# EAGLE design CurveTracerArduinoV2 (EAGLE 7.4.0)
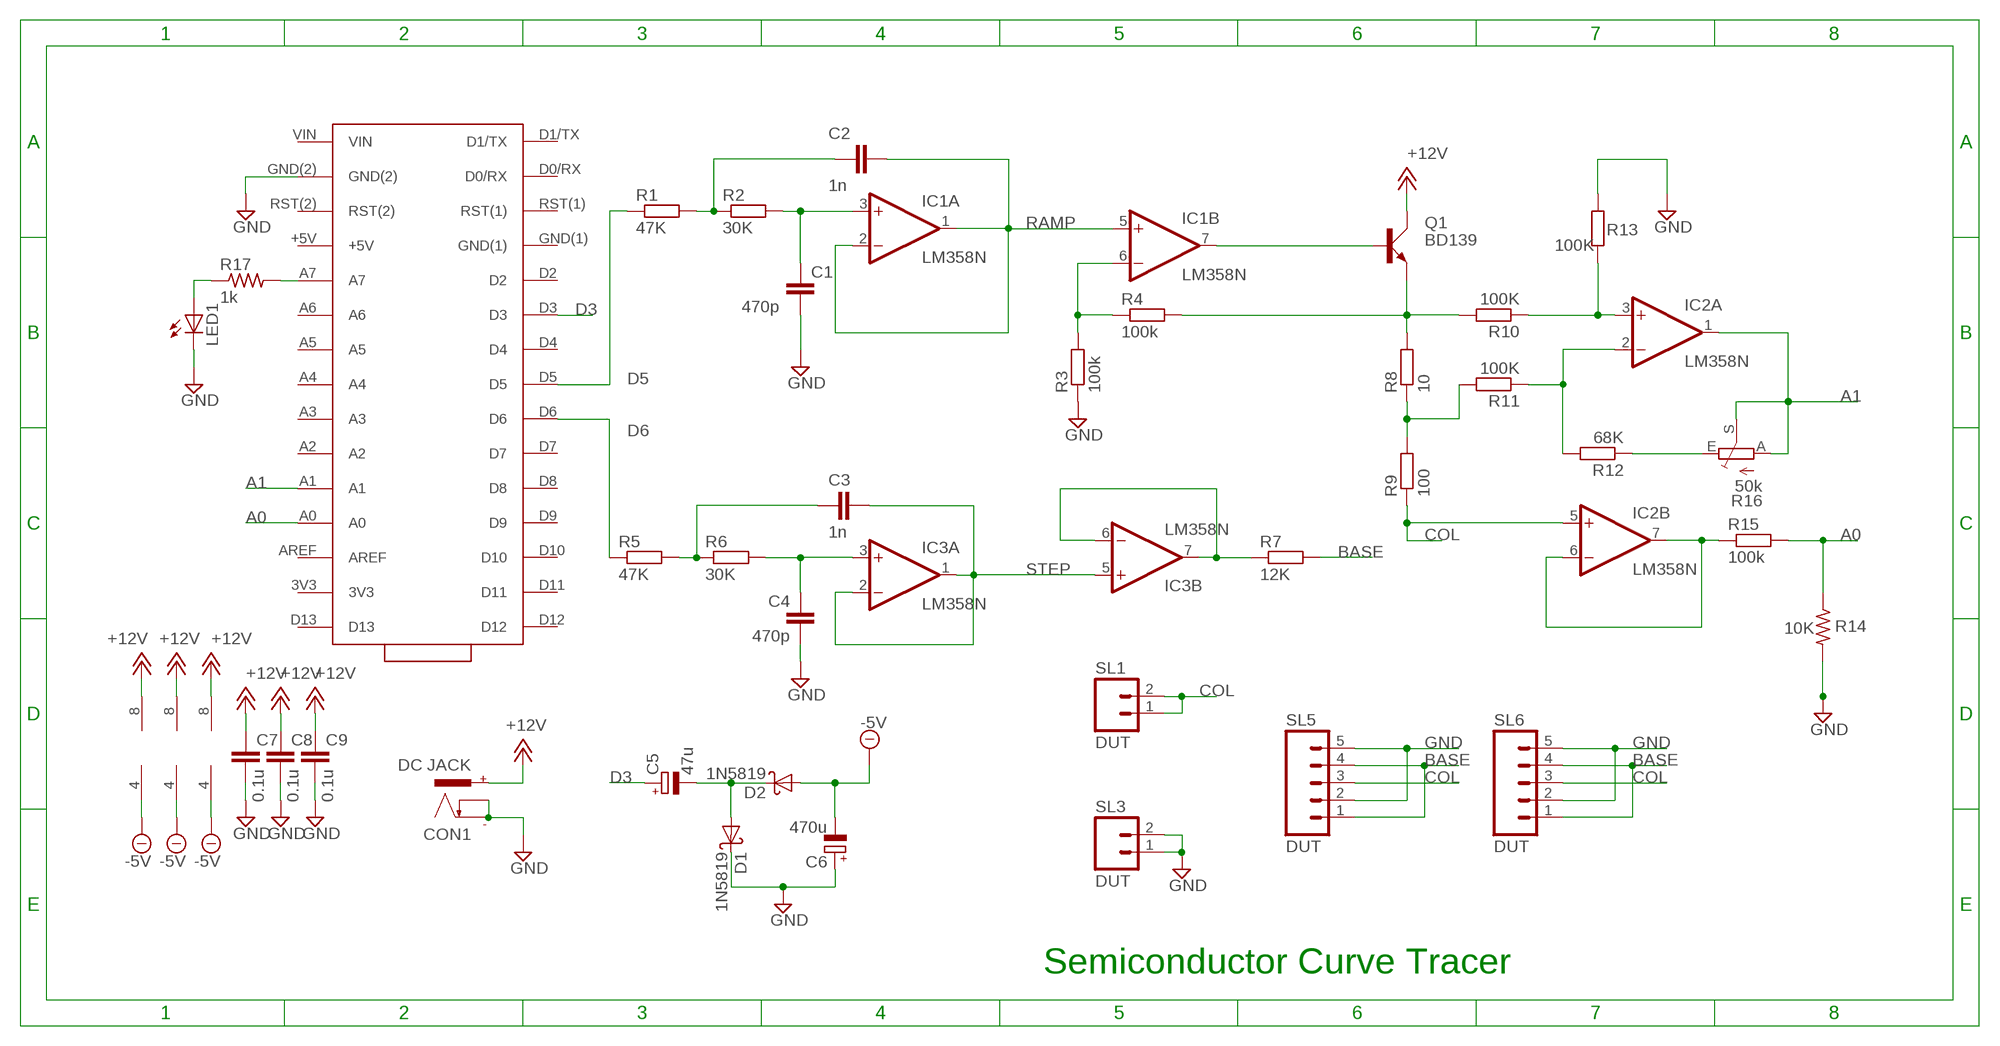
[diagram p0: schematic, sheet 1]

## Parts
C1  470p  C-EU025-024X044  [C025-024X044]
C2  1n  C-EU025-024X044  [C025-024X044]
C3  1n  C-EU025-024X044  [C025-024X044]
C4  470p  C-EU025-024X044  [C025-024X044]
C5  47u  CPOL-EUE2.5-5  [E2,5-5]
C6  470u  CPOL-EUE2.5-5  [E2,5-5]
C7  0.1u  C-EU025-024X044  [C025-024X044]
C8  0.1u  C-EU025-024X044  [C025-024X044]
C9  0.1u  C-EU025-024X044  [C025-024X044]
CON1  DC JACK  POWER_CON  [NEB21R]
D1  1N5819  [DO41-10]
D2  1N5819  [DO41-10]
IC1  LM358N  [DIL08]
IC2  LM358N  [DIL08]
IC3  LM358N  [DIL08]
LED1  RED LED  LED3MM  [LED3MM]
NANO  ARDUINO(NANO_3.0)  [ARDUINO_NANO_30PIN]
Q1  BD139  [TO126AV]
R1  47K  R-EU_0207/10  [0207/10]
R2  30K  R-EU_0204/7  [0204/7]
R3  100k  R-EU_0207/10  [0207/10]
R4  100k  R-EU_0207/10  [0207/10]
R5  47K  R-EU_0204/7  [0204/7]
R6  30K  R-EU_0204/7  [0204/7]
R7  12K  R-EU_0207/10  [0207/10]
R8  10  R-EU_0207/10  [0207/10]
R9  100  R-EU_0207/10  [0207/10]
R10  100K  R-EU_0207/10  [0207/10]
R11  100K  R-EU_0207/10  [0207/10]
R12  68K  R-EU_0204/7  [0204/7]
R13  100K  R-EU_0204/7  [0204/7]
R14  10K  R-US_0207/10  [0207/10]
R15  100k  R-EU_0204/7  [0204/7]
R16  50k  TRIM_EU-S64W  [S64W]
R17  1k  R-US_0204/7  [0204/7]
SL1  DUT  M02  [02P]
SL3  DUT  M02  [02P]
SL5  DUT  M05  [05P]
SL6  DUT  M05  [05P]

## Nets
+12V: C7.1 C8.1 C9.1 CON1.+ IC1.8(P:V+) IC2.8(P:V+) IC3.8(P:V+) Q1.C
-5V: C6.- D2.A IC1.4(P:V-) IC2.4(P:V-) IC3.4(P:V-)
A0: NANO.A0 R14.1 R15.2
A1: IC2.1(A:OUT) NANO.A1 R16.A R16.S
BASE: R7.2 SL5.1 SL5.4 SL6.1 SL6.4
COL: IC2.5(B:+IN) R9.1 SL1.1 SL1.2 SL5.3 SL6.3
D3: C5.+ NANO.D3
D5: NANO.D5 R1.1
D6: NANO.D6 R5.1
GND: C1.2 C4.1 C6.+ C7.2 C8.2 C9.2 CON1.- CON1.C D1.C LED1.K(C) NANO.GND(2) R3.1 R13.1 R14.2 SL3.1 SL3.2 SL5.2 SL5.5 SL6.2 SL6.5
N$1: C5.- D1.A D2.C
N$3: C2.1 R1.2 R2.1
N$4: C1.1 IC1.3(A:+IN) R2.2
N$5: IC3.6(B:-IN) IC3.7(B:OUT) R7.1
N$6: IC1.7(B:OUT) Q1.B
N$8: IC1.6(B:-IN) R3.2 R4.1
N$9: C3.1 R5.2 R6.1
N$10: C4.2 IC3.3(A:+IN) R6.2
N$12: Q1.E R4.2 R8.2 R10.2
N$13: IC2.3(A:+IN) R10.1 R13.2
N$14: IC2.2(A:-IN) R11.1 R12.2
N$16: IC2.6(B:-IN) IC2.7(B:OUT) R15.1
N$17: R12.1 R16.E
N$18: R8.1 R9.2 R11.2
N$19: LED1.A R17.1
N$20: NANO.A7 R17.2
RAMP: C2.2 IC1.1(A:OUT) IC1.2(A:-IN) IC1.5(B:+IN)
STEP: C3.2 IC3.1(A:OUT) IC3.2(A:-IN) IC3.5(B:+IN)
Unconnected: NANO.3V3 NANO.+5V NANO.A2 NANO.A3 NANO.A4 NANO.A5 NANO.A6 NANO.AREF NANO.D0/RX NANO.D1/TX NANO.D2 NANO.D4 NANO.D7 NANO.D8 NANO.D9 NANO.D10 NANO.D11 NANO.D12 NANO.D13 NANO.GND(1) NANO.RST(1) NANO.RST(2) NANO.VIN

## Notes on the sheet
- Semiconductor Curve Tracer

## Library data of the parts
C1-C4 C7-C9 = rcl:C-EU: CAPACITOR, European symbol
C5 C6 = rcl:CPOL-EU: POLARIZED CAPACITOR, European symbol
CON1 = CEDTv83:POWER_CON: DC Power Connector
D1 D2 = CEDTv83:1N5819: DIODE general purpose rectifier, 1 A
IC1-IC3 = CEDTv81:LM358: OP AMP also LM158; LM258; LM2904 Source: http://cache.national.com/ds/LM/LM158.pdf
LED1 = CEDT_JANUARY_2015_v5_a:LED
NANO = Arduino_Nano_3:ARDUINO(NANO_3.0)
Q1 = transistor-power:BD139: NPN TRANSISTOR
R1 R2 R5 R6 R8 R10-R13 R15 = rcl:R-EU_: RESISTOR, European symbol
R3 R4 R7 R9 = resistor:R-EU_: RESISTOR, European symbol
R14 R17 = rcl:R-US_: RESISTOR, American symbol
R16 = pot:TRIM_EU-: POTENTIOMETER
SL1 SL3 = CEDTv81:M02: AMP QUICK CONNECTOR
SL5 SL6 = con-amp-quick:M05: AMP QUICK CONNECTOR; OC_FARNELL: unknown; OC_NEWARK: unknown

## Net classes
0 +12V: width 0.61 mm, drill 0.61 mm, clearance 0.61 mm
1 -5V: width 0.61 mm, drill 0.61 mm, clearance 0.61 mm

## Board
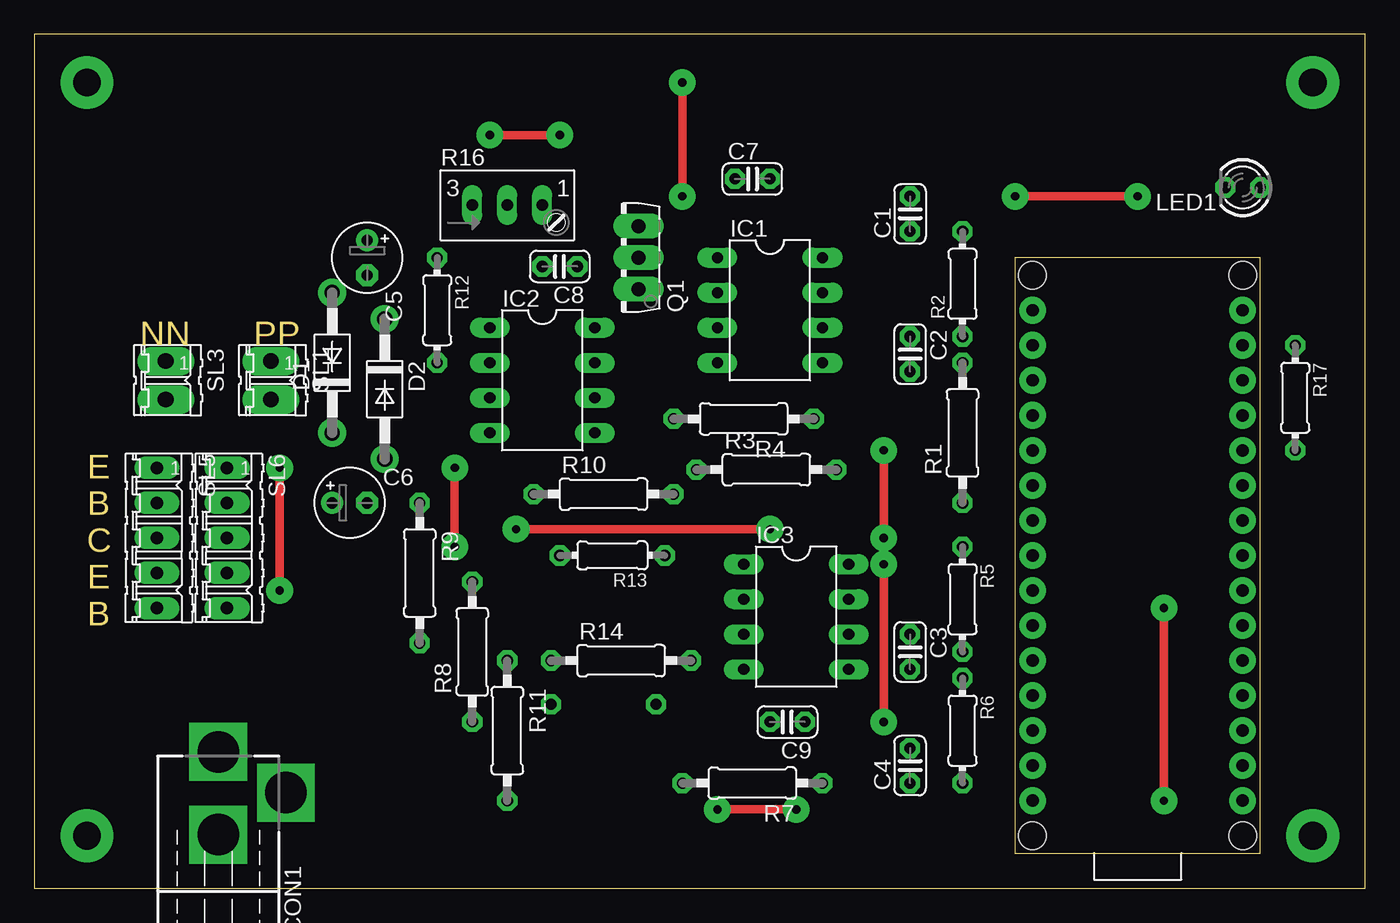
[diagram p1: board, top side]
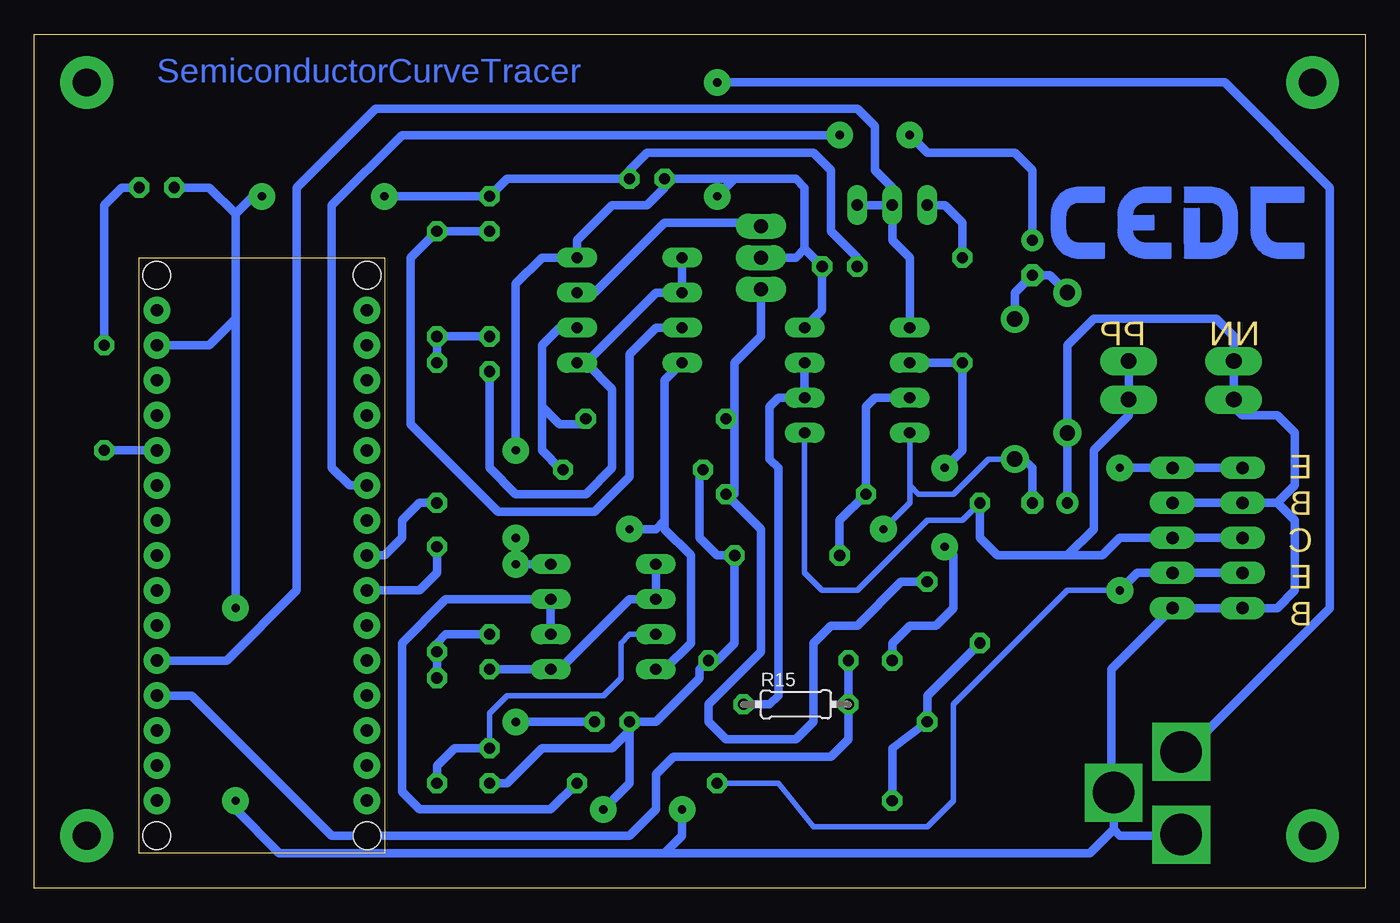
[diagram p2: board, bottom side, seen from below]

Size 96.5 x 61.9 mm. Coordinates in mm from the lower left corner, seen from the top.
Outline: 0,0 96.5,0 96.5,61.9 0,61.9 0,0
Copper layers (1*16): Top 0.035mm / dielectric 1.5mm / Bottom 0.035mm
Design rules "default *": minimum track width 12mil, minimum drill 24mil, track to track 16mil, track to pad 16mil, pad to pad 16mil, via to via 16mil, smd to smd 8mil, copper to edge 40mil, drill to drill 8mil, minimum pad ring 12mil, minimum via ring 12mil, stop-mask expansion 4mil, vias tented up to drill 0mil, thermal gap 10mil

### Footprints (pad centres in the part's own frame; a part is rotated, then mirrored left to right if it is on the bottom)
C025-024X044 = drill 0.813 octagon: 1 -1.27,0; 2 1.27,0
E2,5-5 = drill 0.813 pad 1.6: + -1.27,0 | drill 0.813 pad 1.6 octagon: - 1.27,0
NEB21R = drill 3 pad 4.2 square: + 0,3.54; - 0,-2.46; C 4.9,0.59
DO41-10 = drill 1.118: A 5.08,0; C -5.08,0
DIL08 = drill 0.813 long: 1 -3.81,-3.81; 2 -1.27,-3.81; 3 1.27,-3.81; 4 3.81,-3.81; 5 3.81,3.81; 6 1.27,3.81; 7 -1.27,3.81; 8 -3.81,3.81
LED3MM = drill 0.813 octagon: A -1.27,0; K 1.27,0
ARDUINO_NANO_30PIN = drill 0.9 pad 1.93: 3V3 16.51,6.35; +5V 16.51,31.75; A0 16.51,11.43; A1 16.51,13.97; A2 16.51,16.51; A3 16.51,19.05; A4 16.51,21.59; A5 16.51,24.13; A6 16.51,26.67; A7 16.51,29.21; AREF 16.51,8.89; D0/RX 1.27,36.83; D1/TX 1.27,39.37; D2 1.27,29.21; D3 1.27,26.67; D4 1.27,24.13; D5 1.27,21.59; D6 1.27,19.05; D7 1.27,16.51; D8 1.27,13.97; D9 1.27,11.43; D10 1.27,8.89; D11 1.27,6.35; D12 1.27,3.81; D13 16.51,3.81; GND(1) 1.27,31.75; GND(2) 16.51,36.83; RST(1) 1.27,34.29; RST(2) 16.51,34.29; VIN 16.51,39.37 | hole 2: 1.27,41.91; 16.51,41.91; 16.51,1.27; 1.27,1.27
TO126AV = drill 1.016 long: B 2.286,-1.27; C 0,-1.27; E -2.286,-1.27
0207/10 = drill 0.813 octagon: 1 -5.08,0; 2 5.08,0
0204/7 = drill 0.813 octagon: 1 -3.81,0; 2 3.81,0
S64W = drill 0.813 long: A 2.54,1.27; E -2.54,1.27; S 0,1.27
02P = drill 1.143 long: 1 -1.397,0; 2 1.397,0
05P = drill 0.914 long: 1 -5.08,0; 2 -2.54,0; 3 0,0; 4 2.54,0; 5 5.08,0

### Placement (x,y rotation side)
C1  63.5,48.9 90 top
C2  63.5,38.73 270 top
C3  63.5,17.14 270 top
C4  63.5,8.89 90 top
C5  24.13,45.72 270 top
C6  22.86,27.94 0 top
C7  52.07,51.44 0 top
C8  38.1,45.09 180 top
C9  54.61,12.06 180 top
CON1  13.34,6.35 0 top
D1  21.59,38.1 90 top
D2  25.4,36.2 270 top
IC1  53.34,41.91 270 top
IC2  36.83,36.83 270 top
IC3  55.24,19.68 270 top
LED1  87.63,50.8 180 top
NANO  71.12,2.54 0 top
Q1  42.55,45.72 90 top
R1  67.31,33.02 90 top
R2  67.31,43.81 90 top
R3  53.09,30.35 0 top
R4  51.44,34.04 180 top
R5  67.31,20.95 270 top
R6  67.31,11.43 270 top
R7  52.07,7.62 180 top
R8  31.75,17.14 90 top
R9  27.94,22.86 270 top
R10  41.27,28.57 0 top
R11  34.29,11.43 270 top
R12  29.21,41.91 270 top
R13  41.91,24.13 180 top
R14  42.55,16.51 0 top
R15  41.27,13.34 0 bottom
R16  34.29,48.26 0 top
R17  91.44,35.56 270 top
SL1  17.14,36.83 270 top
SL3  9.53,36.83 270 top
SL5  8.89,25.4 270 top
SL6  13.97,25.4 270 top
U$2  [LOGO-CEDT-BOT-18MM]  4.45,45.72 0 top

### Tracks (layer width: path | path; a pad name or v marks a point on that pad's centre or on a via)
+12V  (via drill 0.6 pad 1.93)
  Top 0.61: v46.99,58.42 v46.99,50.16 | v61.59,12.06 v61.59,23.5 | v61.59,25.4 v61.59,31.75
  Bottom 0.61: 45.72,51.44 C7.1 50.8,50.8 52.07,49.53 54.61,49.53 57.15,46.99 IC1.8 59.69,45.72 61.59,43.81 v61.59,31.75 | 45.72,51.44 41.27,51.44 40.64,50.8 40.64,46.35 | 40.64,46.35 C8.1 39.37,41.91 IC2.8 | Q1.C 41.27,45.72 40.64,46.35 | v46.99,58.42 10.16,58.42 2.54,50.8 2.54,20.32 12.97,9.89 CON1.+ | v46.99,50.16 45.72,51.44 | C9.1 v61.59,12.06 | IC3.8 v61.59,23.5 v61.59,25.4
-5V  (via drill 0.6 pad 1.93)
  Top 0.61: v34.92,26.04 v53.34,26.04
  Bottom 0.406: D2.A 27.3,31.11 29.84,28.57 32.38,28.57 33.02,29.21 | 33.02,29.21 IC2.4 | 33.02,29.21 33.02,27.94 v34.92,26.04
  Bottom 0.61: IC3.4 50.8,15.88 48.9,17.78 48.9,24.13 50.8,26.04 50.8,26.67 | 50.8,26.67 50.8,36.83 IC1.4 | D2.A 24.77,31.11 24.13,30.48 C6.- | v53.34,26.04 51.44,26.04 50.8,26.67
A0
  Bottom 0.61: R14.1 R15.2 37.47,10.79 38.73,9.53 50.16,9.53 51.44,8.26 51.44,5.71 53.34,3.81 74.93,3.81 85.09,13.97 NANO.A0
A1
  Bottom 0.61: R16.S R16.A | R16.S 34.29,46.99 33.02,45.72 IC2.1 | NANO.A1 82.55,16.51 77.47,21.59 77.47,50.8 71.75,56.52 36.83,56.52 35.56,55.24 35.56,52.07 34.29,50.8 R16.S
BASE  (via drill 0.6 pad 1.93)
  Top 0.61: v17.78,30.48 v17.78,21.59
  Bottom 0.406: R7.2 42.55,7.62 40.01,4.45 31.75,4.45 29.84,6.35 29.84,13.34 21.59,21.59 v17.78,21.59
  Bottom 0.61: v17.78,30.48 SL6.1 SL5.1 | SL5.4 SL6.4 16.51,22.86 v17.78,21.59
COL
  Bottom 0.406: IC2.5 40.64,22.86 39.37,21.59 36.83,21.59 31.75,26.67 29.21,26.67 R9.1
  Bottom 0.61: R9.1 27.94,25.4 26.67,24.13 21.59,24.13 | SL5.3 SL6.3 17.78,25.4 19.05,24.13 21.59,24.13 | SL1.1 SL1.2 17.14,34.29 19.68,31.75 19.68,26.04 21.59,24.13
D3  (via drill 0.6 pad 1.93)
  Top 0.61: v33.02,54.61 v38.1,54.61
  Bottom 0.61: NANO.D3 73.66,29.21 74.93,30.48 74.93,49.53 69.85,54.61 v38.1,54.61 | C5.+ 24.13,52.07 25.4,53.34 31.75,53.34 v33.02,54.61
D5
  Bottom 0.61: NANO.D5 71.12,24.13 69.85,25.4 69.85,26.67 68.58,27.94 R1.1
D6
  Bottom 0.61: NANO.D6 68.58,21.59 67.31,22.86 R5.1
GND  (via drill 0.6 pad 1.93)
  Top 0.61: v71.12,50.16 v80.01,50.16 | v81.92,20.32 v81.92,6.35 | v55.24,5.71 v49.53,5.71
  Bottom 0.61: R3.1 48.26,30.1 48.26,25.4 46.99,24.13 R13.1 45.72,17.78 46.99,16.51 R14.2 48.26,15.88 48.26,15.24 51.44,12.06 C9.2 53.34,11.43 | v71.12,50.16 C1.2 62.23,51.44 C7.2 53.34,52.07 52.07,53.34 40.01,53.34 38.73,52.07 38.73,47.62 36.83,45.72 C8.2 | v80.01,50.16 80.64,50.16 81.92,48.9 | 81.92,48.9 81.92,41.27 | 81.92,41.27 83.82,39.37 NANO.GND(2) | 81.92,41.27 v81.92,20.32 | v81.92,6.35 81.92,5.71 78.74,2.54 50.8,2.54 | 50.8,2.54 19.96,2.54 18.23,4.26 | C4.1 62.23,7.62 59.69,10.16 54.61,10.16 53.34,11.43 | 53.34,11.43 53.34,7.62 v55.24,5.71 | v49.53,5.71 49.53,3.81 50.8,2.54 | 18.23,4.26 CON1.C 18.41,7.12 18.41,15.88 SL6.5 SL5.5 6.35,20.32 5.08,21.59 5.08,26.67 6.35,27.94 | 18.23,4.26 17.78,3.81 13.41,3.81 CON1.- | LED1.K 83.82,50.8 81.92,48.9 | 6.35,27.94 SL5.2 SL6.2 | 6.35,27.94 5.08,29.21 5.08,33.02 6.35,34.29 8.89,34.29 9.53,34.92 SL3.2 SL3.1 9.53,40.01 10.79,41.27 19.68,41.27 21.59,39.37 D1.C C6.+
N$1
  Bottom 0.61: D1.A 22.86,44.45 C5.- 25.4,43.18 D2.C
N$2  (via drill 2 pad 3.81)
  other vias: 3.81,3.81
N$3
  Bottom 0.61: R1.2 R2.1 C2.1
N$4
  Bottom 0.61: C1.1 R2.2 69.22,45.72 69.22,33.66 62.87,27.3 55.88,27.3 53.34,29.84 53.34,38.73 51.44,40.64 IC1.3
N$5
  Bottom 0.61: IC3.6 IC3.7 66.67,20.95 69.85,17.78 69.85,6.99 68.58,5.71 59.05,5.71 R7.1
N$6
  Bottom 0.61: IC1.7 55.88,43.18 50.8,48.26 44.07,48.26 Q1.B
N$7  (via drill 2 pad 3.81)
  other vias: 92.71,3.81
N$8
  Bottom 0.61: IC1.6 58.42,40.64 59.69,39.37 59.69,34.92 | 59.69,34.92 58.42,33.66 56.9,33.66 R4.1 | R3.2 58.29,30.35 59.69,31.75 59.69,34.92
N$9
  Bottom 0.61: R6.1 R5.2 67.31,17.78 66.67,18.41 C3.1
N$10
  Bottom 0.406: IC3.3 53.34,18.41 53.98,17.78 53.98,15.24 55.24,13.97 62.23,13.97 63.5,12.7 C4.2
  Bottom 0.61: R6.2 67.31,8.89 66.04,10.16 C4.2
N$11  (via drill 2 pad 3.81)
  other vias: 3.81,58.42
N$12
  Bottom 0.61: R4.2 46.1,34.04 45.72,33.66 | 45.72,33.66 45.72,28.57 R10.2 43.81,26.04 43.81,17.14 47.62,13.34 47.62,12.06 46.35,10.79 41.27,10.79 40.01,12.06 40.01,17.78 38.73,19.05 36.83,19.05 33.66,22.23 R8.2 | Q1.E 43.81,40.01 45.72,38.1 45.72,33.66
N$13
  Bottom 0.61: IC2.3 35.56,35.56 36.2,34.92 R10.1 38.1,26.67 R13.2
N$14  (via drill 0.6 pad 1.93)
  Top 0.61: v30.48,24.77 v30.48,30.48
  Bottom 0.61: IC2.2 R12.2 29.21,31.75 v30.48,30.48 | R11.1 34.29,17.78 33.02,19.05 31.11,19.05 29.84,20.32 29.84,24.13 v30.48,24.77
N$15  (via drill 2 pad 3.81)
  other vias: 92.71,58.42
N$16
  Bottom 0.61: IC2.7 IC2.6 42.55,35.56 43.18,34.92 43.18,31.11 42.55,30.48 42.55,13.97 43.18,13.34 R15.1
N$17
  Bottom 0.61: R16.E 30.48,49.53 29.21,48.26 R12.1
N$18
  Bottom 0.61: R11.2 34.29,10.16 R8.1 31.75,13.97 R9.2
N$19
  Bottom 0.61: R17.1 91.44,49.53 90.17,50.8 LED1.A
N$20
  Bottom 0.61: R17.2 NANO.A7
RAMP
  Bottom 0.61: IC1.1 IC1.2 51.44,43.18 56.52,38.1 | 56.52,38.1 IC1.5 | C2.2 63.5,30.48 61.59,28.57 56.52,28.57 54.61,30.48 54.61,36.2 56.52,38.1
STEP
  Bottom 0.61: C3.2 IC3.5 58.42,15.88 53.34,20.95 IC3.2 IC3.1

### Text on the board
Bottom: SemiconductorCurveTracer
Dimension: NN | PP | E / B / C / E / B